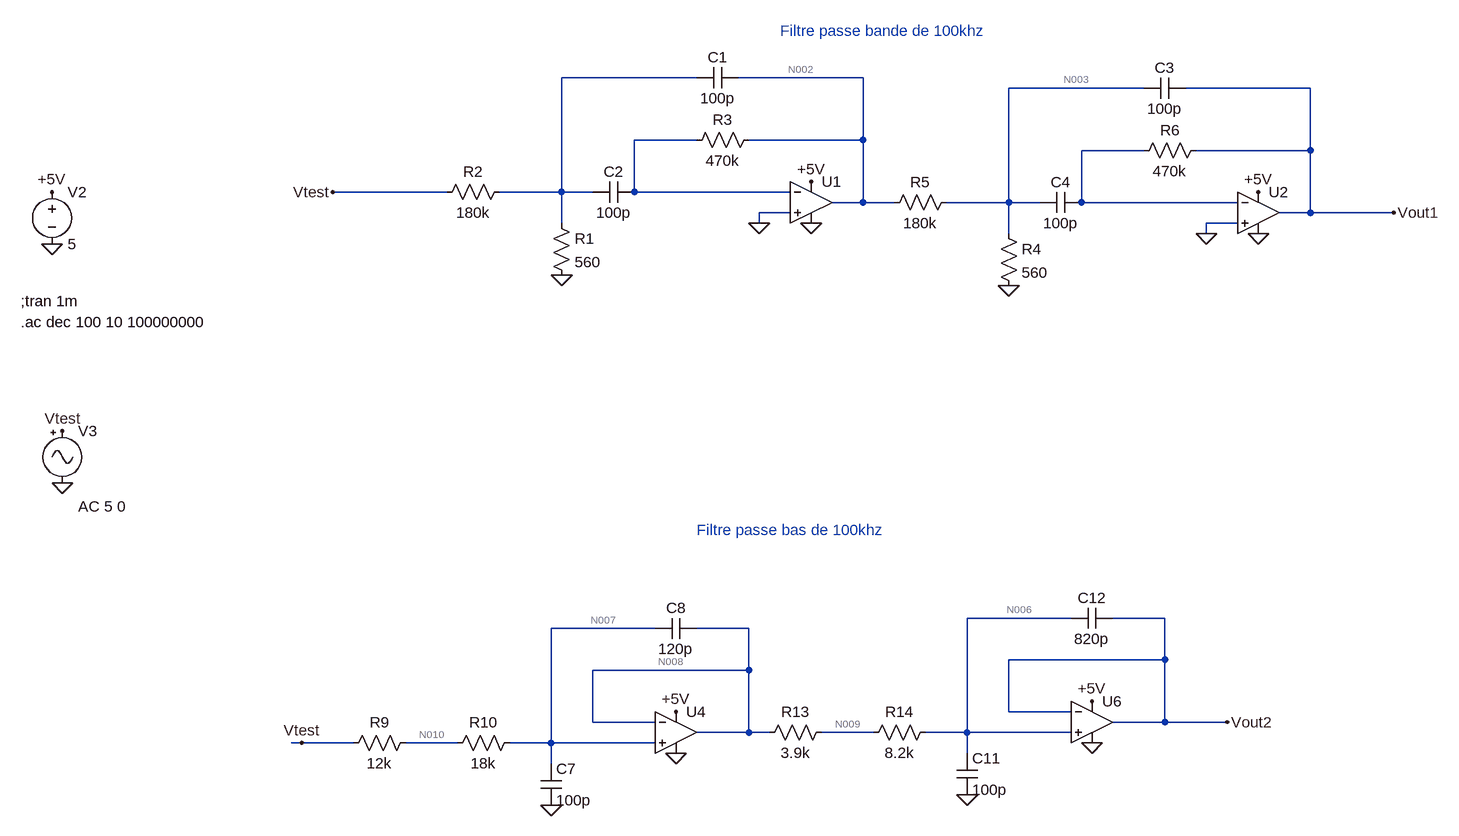
[diagram p0: schematic Filtres.asc]
Filtres.asc, the LTspice schematic file:
Version 4
SHEET 1 1464 1112
WIRE 208 -128 0 -128
WIRE 464 -128 272 -128
WIRE 896 -112 688 -112
WIRE 1152 -112 960 -112
WIRE 208 -32 112 -32
WIRE 464 -32 464 -128
WIRE 464 -32 288 -32
WIRE 896 -16 800 -16
WIRE 1152 -16 1152 -112
WIRE 1152 -16 976 -16
WIRE -176 48 -352 48
WIRE 0 48 0 -128
WIRE 0 48 -96 48
WIRE 48 48 0 48
WIRE 112 48 112 -32
WIRE 352 48 112 48
WIRE 464 64 464 -32
WIRE 464 64 416 64
WIRE 512 64 464 64
WIRE 688 64 688 -112
WIRE 688 64 592 64
WIRE 736 64 688 64
WIRE 800 64 800 -16
WIRE 1040 64 800 64
WIRE 352 80 304 80
WIRE 1152 80 1152 -16
WIRE 1152 80 1104 80
WIRE 1280 80 1152 80
WIRE 0 96 0 48
WIRE 304 96 304 80
WIRE 1040 96 992 96
WIRE 688 112 688 64
WIRE 992 112 992 96
WIRE 784 704 624 704
WIRE 928 704 848 704
WIRE 144 720 -16 720
WIRE 288 720 208 720
WIRE 928 768 928 704
WIRE 928 768 688 768
WIRE 288 784 288 720
WIRE 288 784 48 784
WIRE 688 848 688 768
WIRE 784 848 688 848
WIRE 48 864 48 784
WIRE 144 864 48 864
WIRE 928 864 928 768
WIRE 928 864 848 864
WIRE 1024 864 928 864
WIRE 288 880 288 784
WIRE 288 880 208 880
WIRE 320 880 288 880
WIRE 480 880 400 880
WIRE 624 880 624 704
WIRE 624 880 560 880
WIRE 784 880 624 880
WIRE -400 896 -416 896
WIRE -320 896 -400 896
WIRE -160 896 -240 896
WIRE -16 896 -16 720
WIRE -16 896 -80 896
WIRE 144 896 -16 896
WIRE 624 912 624 880
WIRE -16 928 -16 896
FLAG 304 96 0
FLAG 0 176 0
FLAG 384 96 0
FLAG 992 112 0
FLAG 688 192 0
FLAG 1072 112 0
FLAG -352 48 Vtest
FLAG 1280 80 Vout1
FLAG 624 976 0
FLAG 816 896 0
FLAG -16 992 0
FLAG 176 912 0
FLAG -784 128 0
FLAG -784 48 +5V
FLAG 384 32 +5V
FLAG 1072 48 +5V
FLAG 816 832 +5V
FLAG 176 848 +5V
FLAG -768 496 0
FLAG -400 896 Vtest
FLAG 1024 864 Vout2
FLAG -768 416 Vtest
SYMBOL OpAmps\\UniversalOpAmp 384 64 R0
SYMATTR InstName U1
SYMBOL res -16 80 R0
SYMATTR InstName R1
SYMATTR Value 560
SYMBOL res -80 32 R90
WINDOW 0 0 56 VBottom 2
WINDOW 3 32 56 VTop 2
SYMATTR InstName R2
SYMATTR Value 180k
SYMBOL res 192 -16 R270
WINDOW 0 32 56 VTop 2
WINDOW 3 0 56 VBottom 2
SYMATTR InstName R3
SYMATTR Value 470k
SYMBOL cap 272 -144 R90
WINDOW 0 0 32 VBottom 2
WINDOW 3 32 32 VTop 2
SYMATTR InstName C1
SYMATTR Value 100p
SYMBOL cap 112 32 R90
WINDOW 0 0 32 VBottom 2
WINDOW 3 32 32 VTop 2
SYMATTR InstName C2
SYMATTR Value 100p
SYMBOL OpAmps\\UniversalOpAmp 1072 80 R0
SYMATTR InstName U2
SYMBOL res 672 96 R0
SYMATTR InstName R4
SYMATTR Value 560
SYMBOL res 608 48 R90
WINDOW 0 0 56 VBottom 2
WINDOW 3 32 56 VTop 2
SYMATTR InstName R5
SYMATTR Value 180k
SYMBOL res 880 0 R270
WINDOW 0 32 56 VTop 2
WINDOW 3 0 56 VBottom 2
SYMATTR InstName R6
SYMATTR Value 470k
SYMBOL cap 960 -128 R90
WINDOW 0 0 32 VBottom 2
WINDOW 3 32 32 VTop 2
SYMATTR InstName C3
SYMATTR Value 100p
SYMBOL cap 800 48 R90
WINDOW 0 0 32 VBottom 2
WINDOW 3 32 32 VTop 2
SYMATTR InstName C4
SYMATTR Value 100p
SYMBOL OpAmps\\UniversalOpAmp 816 864 R0
SYMATTR InstName U6
SYMBOL cap 608 912 R0
SYMATTR InstName C11
SYMATTR Value 100p
SYMBOL res 416 864 R90
WINDOW 0 0 56 VBottom 2
WINDOW 3 32 56 VTop 2
SYMATTR InstName R13
SYMATTR Value 3.9k
SYMBOL res 576 864 R90
WINDOW 0 0 56 VBottom 2
WINDOW 3 32 56 VTop 2
SYMATTR InstName R14
SYMATTR Value 8.2k
SYMBOL cap 848 688 R90
WINDOW 0 0 32 VBottom 2
WINDOW 3 32 32 VTop 2
SYMATTR InstName C12
SYMATTR Value 820p
SYMBOL OpAmps\\UniversalOpAmp 176 880 R0
SYMATTR InstName U4
SYMBOL cap -32 928 R0
SYMATTR InstName C7
SYMATTR Value 100p
SYMBOL res -224 880 R90
WINDOW 0 0 56 VBottom 2
WINDOW 3 32 56 VTop 2
SYMATTR InstName R9
SYMATTR Value 12k
SYMBOL res -64 880 R90
WINDOW 0 0 56 VBottom 2
WINDOW 3 32 56 VTop 2
SYMATTR InstName R10
SYMATTR Value 18k
SYMBOL cap 208 704 R90
WINDOW 0 0 32 VBottom 2
WINDOW 3 32 32 VTop 2
SYMATTR InstName C8
SYMATTR Value 120p
SYMBOL voltage -784 32 R0
WINDOW 123 0 0 Left 0
WINDOW 39 0 0 Left 0
SYMATTR InstName V2
SYMATTR Value 5
SYMBOL Misc\\signal -768 400 R0
WINDOW 123 24 132 Left 2
WINDOW 39 0 0 Left 0
WINDOW 3 -93 167 Left 2
SYMATTR Value2 AC 5 0
SYMATTR InstName V3
SYMATTR Value ""
TEXT -832 248 Left 2 !.ac dec 100 10 100000000
TEXT -832 216 Left 2 !;tran 1m
TEXT 208 568 Left 2 ;Filtre passe bas de 100khz
TEXT 336 -200 Left 2 ;Filtre passe bande de 100khz

The netlist it stands for:
* Filtres.asc
XU1 0 N004 +5V 0 N002 level1 Avol=1Meg GBW=10Meg Vos=0 En=0 Enk=0 In=0 Ink=0 Rin=500Meg  ; pins In+ In- V+ V- OUT
R1 N001 0 560
R2 N001 Vtest 180k
R3 N004 N002 470k
C1 N002 N001 100p
C2 N004 N001 100p
XU2 0 N005 +5V 0 Vout1 level1 Avol=1Meg GBW=10Meg Vos=0 En=0 Enk=0 In=0 Ink=0 Rin=500Meg  ; pins In+ In- V+ V- OUT
R4 N003 0 560
R5 N003 N002 180k
R6 N005 Vout1 470k
C3 Vout1 N003 100p
C4 N005 N003 100p
XU6 N006 Vout2 +5V 0 Vout2 level1 Avol=1Meg GBW=10Meg Vos=0 En=0 Enk=0 In=0 Ink=0 Rin=500Meg  ; pins In+ In- V+ V- OUT
C11 N006 0 100p
R13 N009 N008 3.9k
R14 N006 N009 8.2k
C12 Vout2 N006 820p
XU4 N007 N008 +5V 0 N008 level1 Avol=1Meg GBW=10Meg Vos=0 En=0 Enk=0 In=0 Ink=0 Rin=500Meg  ; pins In+ In- V+ V- OUT
C7 N007 0 100p
R9 N010 Vtest 12k
R10 N007 N010 18k
C8 N008 N007 120p
V2 +5V 0 5
V3 Vtest 0 AC 5 0
.ac dec 100 10 100000000
;tran 1m
* Filtre passe bas de 100khz
* Filtre passe bande de 100khz
.lib UniversalOpAmp1.lib
.backanno
.end

* Results of the author's LTspice run, read from the files saved beside the schematic
* Operating Point, zero values left out:
*   V(n002) = -2.35 mV
*   V(+5v) = 5 V
*   V(vout1) = -2.35 mV
*   V(n003) = -7.288 µV
*   V(vout2) = 210.5 µV
*   V(n006) = 210.5 µV
*   V(n009) = 169.5 µV
*   V(n008) = 150 µV
*   V(n007) = 150 µV
*   V(n010) = 60 µV
*   I(R10) = 5 nA
*   I(R9) = 5 nA
*   I(R14) = 5 nA
*   I(R13) = 5 nA
*   I(R6) = 5 nA
*   I(R5) = 13.02 nA
*   I(R4) = -13.02 nA
*   I(R3) = 5 nA
*   I(V3) = 5 nA
*   I(V2) = -40 nA
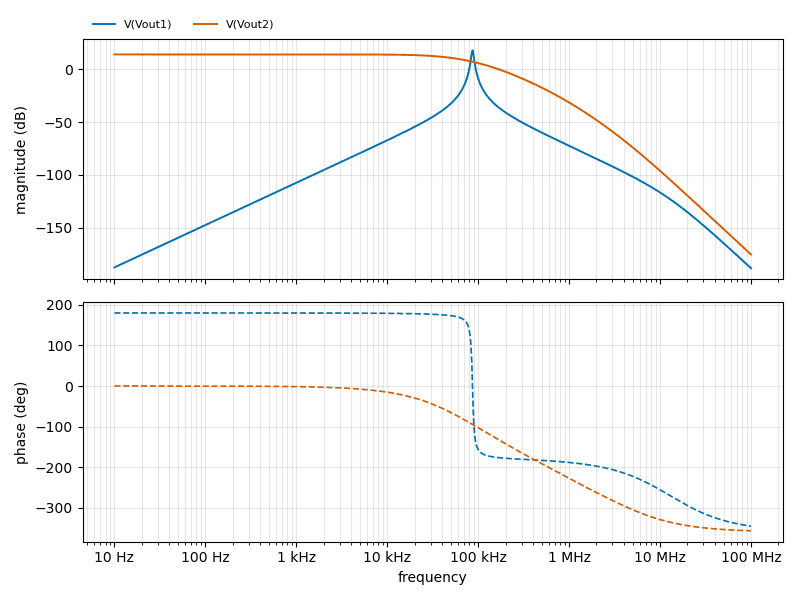
[diagram p1: AC Analysis of Filtres.asc, plotted from the saved traces]
* AC Analysis, 1 run:
*   V(Vout1): -187.55 dB at 10 Hz, -188.30 dB at 100 MHz, peak 17.85 dB at 87.1 kHz, 3 dB below the peak at 84.88 kHz and 88.35 kHz
*   V(Vout2): 13.98 dB at 10 Hz, -175.28 dB at 100 MHz, peak 13.98 dB at 10 Hz, 3 dB below the peak at 48.05 kHz